# Altium schematic sheet MicroControllerSTM32f107VCT.SchDoc
size A4
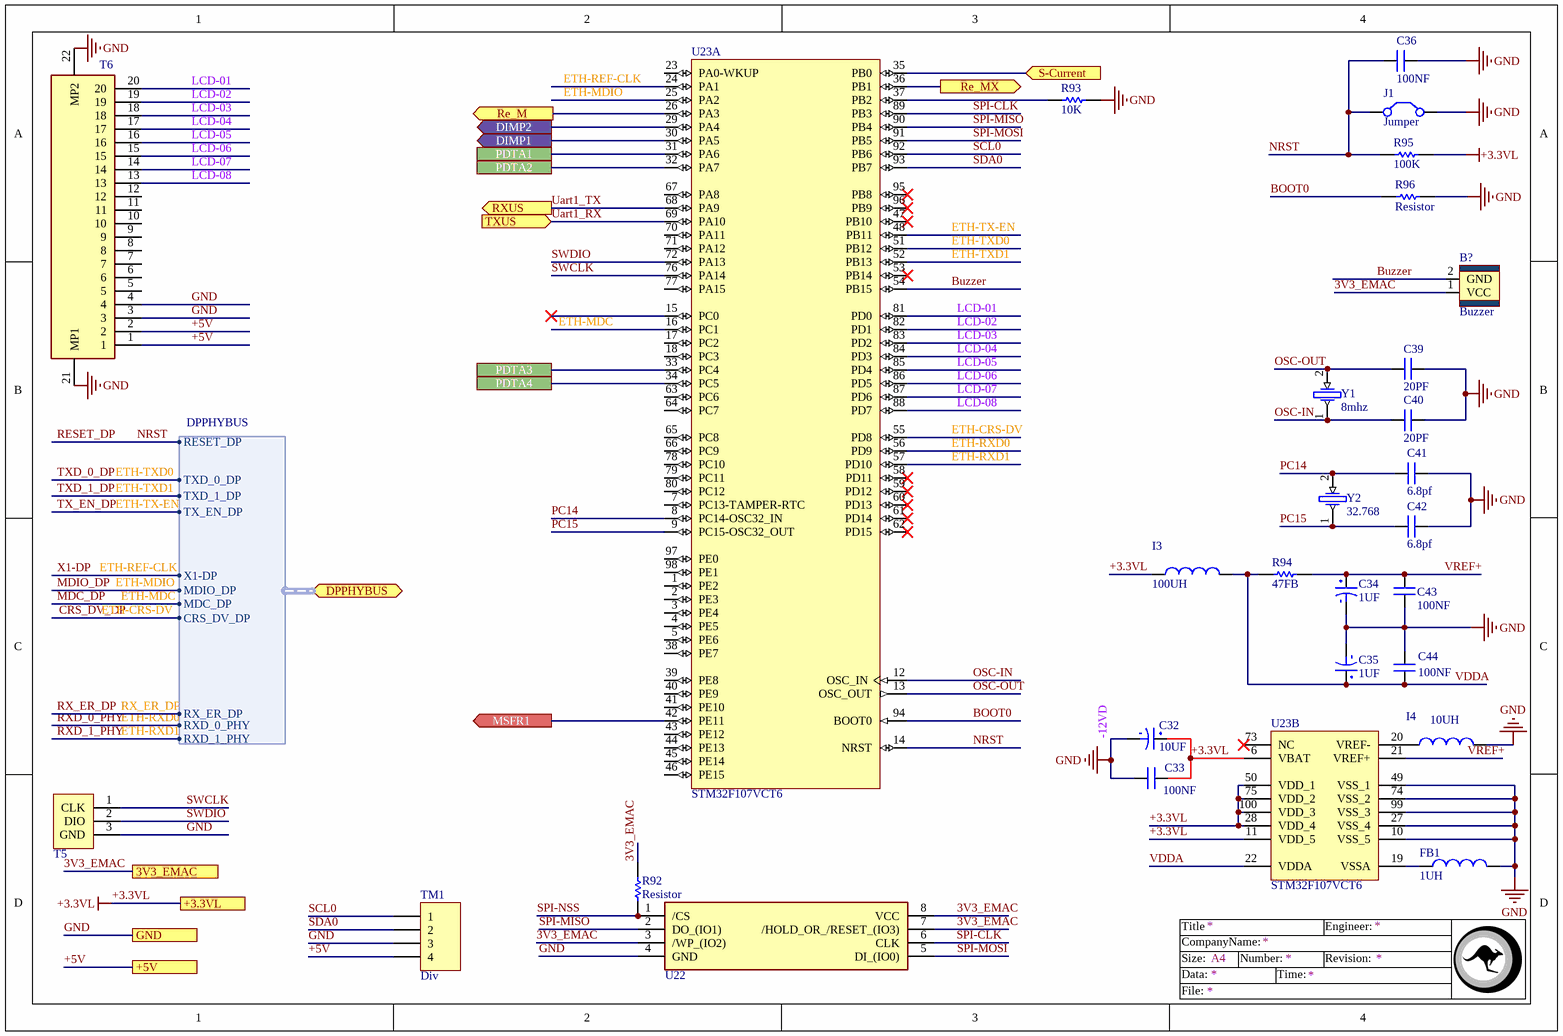
[diagram p0: MicroControllerSTM32f107VCT.SchDoc]

## Parts
B?  Buzzer  [Buzzer]
C32  10UF  [CAPMOL_B]
C33  100NF  [Cap0805]
C34  1UF  [CAPMOL_B]
C35  1UF  [CAPMOL_B]
C36  100NF  [Cap0805]
C39  20PF  [Cap0805]
C40  20PF  [Cap0805]
C41  6.8pf  [Cap0805]
C42  6.8pf  [Cap0805]
C43  100NF  [Cap0805]
C44  100NF  [Cap0805]
FB1  1UH  [1206]
I3  100UH  [1206]
I4  10UH  [1206]
J1  Jumper  [Jumper SMD - Small]
R92  Resistor  [0603]
R93  10K  [R0805]
R94  47FB  [R0805]
R95  100K  [R0805]
R96  Resistor  [R0805]
T5  Serial Program  [MHDR1X03-254P - E]  (value not drawn)
T6  FFC 20PIN 0.5MM  [FFC/SM0.5-20PIN]  (value not drawn)
TM1  Div  [SPOX_1*4RIGHT]
U22  W25Q32FV  [SOIC127P790X216-8N]  (value not drawn)
U23  STM32F107VCT6  [LQFP100_L]  (parts A,B of 2)
Y1  8mhz  [CrystallB]
Y2  32.768  [XTAL RTC]

## Ports
3V3_EMAC, +3.3VL, +5V, DIMP1 (out), DIMP2 (out), DPPHYBUS (bidir, harness DPPHYBUS), GND, MSFR1 (out), PDTA1, PDTA2, PDTA3, PDTA4, Re_M (out), Re_MX (out), RXUS (out), S-Current (in), TXUS (in)

## Harnesses
DPPHYBUS: RESET_DP, TXD_0_DP, X1-DP, TXD_1_DP, TX_EN_DP, MDIO_DP, MDC_DP, CRS_DV_DP, RX_ER_DP, RXD_0_PHY, RXD_1_PHY

## Nets
+3.3VL: C32.2 C33.1 I3.1 R95.1 U23.6(VBAT) U23.11(VDD_5) U23.28(VDD_4) U23.50(VDD_1) U23.75(VDD_2) U23.100(VDD_3) ; port +3.3VL
-12VD: C32.1 C33.2 C34.1 C35.1 C36.2 C39.2 C40.2 C41.2 C42.2 C43.1 C44.2 FB1.2 I4.2 J1.2(C2) R93.1 R96.1 T5.3(GND) T6.3 T6.4 T6.21(MP1) T6.22(MP2) TM1.3 U22.4(GND) U23.10(VSS_5) U23.27(VSS_4) U23.49(VSS_1) U23.74(VSS_2) U23.99(VSS_3) ; port GND  [also labelled GND]
3V3_EMAC: B?.1(VCC) R92.1 U22.3(/WP_(IO2)) U22.7(/HOLD_OR_/RESET_(IO3)) U22.8(VCC) ; port 3V3_EMAC
+5V: T6.1 T6.2 TM1.4 ; port +5V
BOOT0: R96.2 U23.94(BOOT0)
Buzzer: B?.2(GND) U23.54(PB15)
CRS_DV_DP: U23.55(PD8) ; port DPPHYBUS.CRS_DV_DP  [also labelled ETH-CRS-DV]
DIMP1: U23.30(PA5) ; port DIMP1
DIMP2: U23.29(PA4) ; port DIMP2
ETH-MDC: U23.16(PC1) ; port DPPHYBUS.MDC_DP  [also labelled MDC_DP]
ETH-MDIO: U23.25(PA2) ; port DPPHYBUS.MDIO_DP  [also labelled MDIO_DP]
ETH-REF-CLK: U23.24(PA1) ; port DPPHYBUS.X1-DP  [also labelled X1-DP]
ETH-RXD0: U23.56(PD9) ; port DPPHYBUS.RXD_0_PHY  [also labelled RXD_0_PHY]
ETH-RXD1: U23.57(PD10) ; port DPPHYBUS.RXD_1_PHY  [also labelled RXD_1_PHY]
ETH-TX-EN: U23.48(PB11) ; port DPPHYBUS.TX_EN_DP  [also labelled TX_EN_DP]
ETH-TXD0: U23.51(PB12) ; port DPPHYBUS.TXD_0_DP  [also labelled TXD_0_DP]
ETH-TXD1: U23.52(PB13) ; port DPPHYBUS.TXD_1_DP  [also labelled TXD_1_DP]
LCD-01: T6.20 U23.81(PD0)
LCD-02: T6.19 U23.82(PD1)
LCD-03: T6.18 U23.83(PD2)
LCD-04: T6.17 U23.84(PD3)
LCD-05: T6.16 U23.85(PD4)
LCD-06: T6.15 U23.86(PD5)
LCD-07: T6.14 U23.87(PD6)
LCD-08: T6.13 U23.88(PD7)
MSFR1: U23.42(PE11) ; port MSFR1
NRST: C36.1 J1.1(C1) R95.2 U23.14(NRST) ; port DPPHYBUS.RESET_DP  [also labelled RESET_DP]
OSC-IN: C40.1 U23.12(OSC_IN) Y1.1
OSC-OUT: C39.1 U23.13(OSC_OUT) Y1.2
PC14: C41.1 U23.8(PC14-OSC32_IN) Y2.2
PC15: C42.1 U23.9(PC15-OSC32_OUT) Y2.1
PDTA1: U23.31(PA6) ; port PDTA1
PDTA2: U23.32(PA7) ; port PDTA2
PDTA3: U23.33(PC4) ; port PDTA3
PDTA4: U23.34(PC5) ; port PDTA4
Re_M: U23.26(PA3) ; port Re_M
Re_MX: U23.36(PB1) ; port Re_MX
RX_ER_DP: port DPPHYBUS.RX_ER_DP
S-Current: U23.35(PB0) ; port S-Current
SCL0: TM1.1 U23.92(PB6)
SDA0: TM1.2 U23.93(PB7)
SPI-CLK: U22.6(CLK) U23.89(PB3)
SPI-MISO: U22.2(DO_(IO1)) U23.90(PB4)
SPI-MOSI: U22.5(DI_(IO0)) U23.91(PB5)
SPI-NSS: R92.2 U22.1(/CS)
SWCLK: T5.1(CLK) U23.76(PA14)
SWDIO: T5.2(DIO) U23.72(PA13)
Uart1_RX: U23.69(PA10) ; port TXUS
Uart1_TX: U23.68(PA9) ; port RXUS
VDDA: C35.2 C44.1 I3.2 R94.2 U23.22(VDDA)
VREF+: C34.2 C43.2 R94.1 U23.21(VREF+)
NetFB1_1: FB1.1 U23.19(VSSA)
NetI4_1: I4.1 U23.20(VREF-)
NetR93_2: R93.2 U23.37(PB2)

Not connected (* = marked no-connect by the designer): T6 5 6 7 8 9 10 11 12; U23 1(PE2) 2(PE3) 3(PE4) 4(PE5) 5(PE6) 7(PC13-TAMPER-RTC) 15(PC0)* 17(PC2) 18(PC3) 23(PA0-WKUP) 38(PE7) 39(PE8) 40(PE9) 41(PE10) 43(PE12) 44(PE13) 45(PE14) 46(PE15) 47(PB10)* 53(PB14)* 58(PD11)* 59(PD12)* 60(PD13)* 61(PD14)* 62(PD15)* 63(PC6) 64(PC7) 65(PC8) 66(PC9) 67(PA8) 70(PA11) 71(PA12) 73(NC)* 77(PA15) 78(PC10) 79(PC11) 80(PC12) 95(PB8)* 96(PB9)* 97(PE0) 98(PE1)

## Notes on the sheet
- Title
- Size:
- Data:
- CompanyName:
- A4
- Number:
- Time:
- Revision:
- Engineer:
- File:

## Library data of the parts
C32 C34 C35 = Cap_P: Polarity
C33 C36 C39-C44 = Cap: Surface mount Capacitor
FB1 I3 I4 = Inductor: Indicator
R93 R95 = Resistor
R94 = Resistor: FB
T5 = Serial Program: STM Serial Program pin
T6 = FFC 20PIN 0.5MM: LCD
TM1 = SPOX 1*4: SPOX1*4
U22 = W25Q32FV: 32M-BIT / SERIAL FLASH MEMORY
U23 = STM32F107VCT6: STM32 ARM-based 32-bit MCU Connectivity Line & Ethernet with 256 kB Flash, 64 kB Internal RAM, -40 to +85°C Temperature, 100-Pin LQFP, Tray; DatasheetVersion: rev5.0, May-2010; PackageVersion: rev13, Apr-2011; PackageReference: LQFP100; PackageDescription: 100-Pin Low-Profile Quad Flat Pack, 14 x 14 mm Body, 0.5 mm Pitch (LQFP100); ComponentLink1Description: Manufacturer URL; ComponentLink1URL: http://www.st.com/; ComponentLink2Description: STM32F105/107 Datasheet; ComponentLink2URL: http://www.st.com/internet/com/TECHNICAL_RESOURCES/TECHNICAL_LITERATURE/DATASHEET/CD00220364.pdf; ComponentLink3Description: STM32 Family Web Page; ComponentLink3URL: www.st.com/stm32
Y1 Y2 = Crystal